# Altium schematic sheet MASTER.SchDoc: MASTER
size A; Author: Keshav Raj, Tim Loretto; DocumentNumber: 1; Revision: 1.0; SheetNumber: 1; SheetTotal: 4
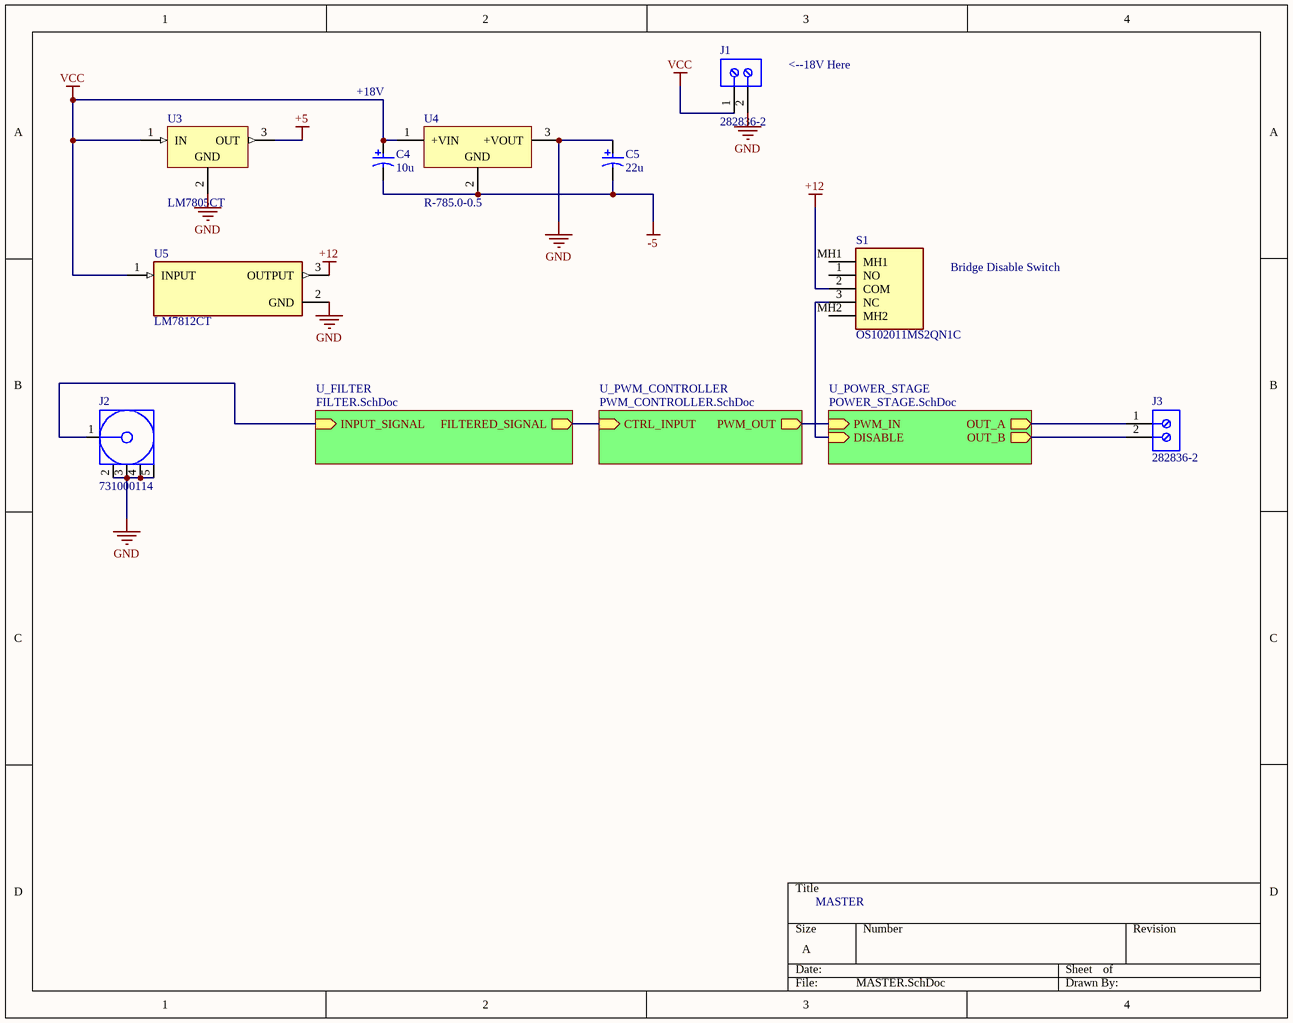
[diagram p0: MASTER.SchDoc]

## Parts
C4  10u  [PNSC-ECA-1VM221-2]
C5  22u  [PNSC-ECA-1VM221-2]
J1  282836-2  [TECO-282836-2_V]
J2  731000114  [MOLX-731000114_V]
J3  282836-2  [TECO-282836-2_V]
S1  OS102011MS2QN1C  [OS102011MS2QN1C]
U3  LM7805CT  [FAIR-TO-220-3]
U4  R-785.0-0.5  [REPO-R-78XX-3_V]
U5  LM7812CT  [FP-TO220B03-MFG]

## Sub-sheets
U_FILTER = FILTER.SchDoc: FILTERED_SIGNAL (out), INPUT_SIGNAL (in)
U_POWER_STAGE = POWER_STAGE.SchDoc: PWM_IN (in), DISABLE (in), OUT_A (out), OUT_B (out)
U_PWM_CONTROLLER = PWM_CONTROLLER.SchDoc: CTRL_INPUT (in), PWM_OUT (out)

## Nets
+5: U3.3(OUT)
+12: S1.2(COM) U5.3(OUTPUT)
-5: C4.2 C5.2 U4.2(GND)
GND: C5.1 J1.2 J2.2 J2.3 J2.4 J2.5 U3.2(GND) U4.3(+VOUT) U5.2(GND)
VCC: C4.1 J1.1 U3.1(IN) U4.1(+VIN) U5.1(INPUT)
NetJ2_1: J2.1 ; sheet U_FILTER/INPUT_SIGNAL
NetJ3_1: J3.1 ; sheet U_POWER_STAGE/OUT_A
NetJ3_2: J3.2 ; sheet U_POWER_STAGE/OUT_B
NetS1_3: S1.3(NC) ; sheet U_POWER_STAGE/DISABLE
(unnamed): sheet U_PWM_CONTROLLER/CTRL_INPUT, sheet U_FILTER/FILTERED_SIGNAL
(unnamed): sheet U_PWM_CONTROLLER/PWM_OUT, sheet U_POWER_STAGE/PWM_IN

Not connected (* = marked no-connect by the designer): S1 1(NO) MH1 MH2

## Notes on the sheet
- +18V
- (near J1) <--18V Here
- Bridge Disable Switch
- MASTER

## Library data of the parts
C4 C5 = CMP-2000-05311-1: Aluminum Electrolytic Capacitor, 220 uF, +/- 20%, 35 V, -40 to 85 degC, 2-Pin THD, RoHS, Bulk; Manufacturer: Panasonic; Lifetime@Temperature: 2000Hrs@85degC; Rated Voltage: 35V; Ripple Current: 350mA; Type: Radial; Capacitance: 220µF; Package Reference: ECA-1VM221; Series: M; Operating Temp Range: -40to+85degC; Package Description: 2-Pin Axial Lead, Dia 8 mm, Body Length 12.5 mm; Datasheet Version: Mar-06; Datasheet URL: https://datasheet.ciiva.com/26341/441851-da-01-en-elko-eca1vm221-m-r-220myf-35v-85c-26341906.pdf; Operating Temp-Max: 85degC; Case Size/Dimension: Ø8x11.5mm; Manufacturer URL: http://www.panasonic.com/
J1 J3 = CMP-1684-00017-1: Female Header, Pitch 5 mm, 1 x 2 Position, Height 10 mm, Tail Length 3.5 mm, Rohs, Bulk; Manufacturer: TE Connectivity; Wire Gauge: 16-30AWG; Product Training Modules: Wire-to-BoardEurostyleTerminalBlocks; Clamp Material - Plating: Brass-NickelPlated; Voltage: 300V; Mating Orientation: HorizontalwithBoard; Current: 13.5A; Pitch: 0.197"(5.00mm); Screw Thread: M3; 3D Model: 282836-2.pdf; Other Names: 5ULV-02B / A98076; Dynamic Catalog: BuchananSeries; Number of Levels: 1; Torque - Screw: 0.68Nm(6Lb-In); Featured Product: EurostyleTerminalBlockConnectors; Positions Per Level: 2; Wire Termination: Screw-RisingCageClamp; Datasheet URL: http://www.te.com.cn/commerce/DocumentDelivery/DDEController?Action=showdoc&DocId=Catalog+Section%7F1308389_EUROSTYLE_TERMINAL_BLOCKS%7F0607%7Fpdf%7FEnglish%7FENG_CS_1308389_EUROSTYLE_TERMINAL_BLOCKS_0607.pdf%7F282836-2; Color: Green; Family: TerminalBlocks-WiretoBoard; RoHS Information: 282836-2StatementofCompliance; Standard Package: 300; Contact Material - Plating: Brass-TinPlated; Manufacturer URL: http://www.te.com; Housing Material: Polyamide(PA66),Nylon6/6; Features: Interlocking(Side); Package Description: Female Header, Pitch 5 mm, 1 x 2 Position, Height 10 mm, Tail Length 3.5 mm; Mounting Type: ThroughHole; Package Reference: THD; Packaging: Bulk; Series: Buchanan; Category: Connectors,Interconnects; Screw Material - Plating: Brass-NickelPlated
J2 = CMP-2000-05487-1: SMA Right-Angle PCB Jack Receptacle, Brass Body, Gold Plated, 50 Ohm, 5-Pin THD, RoHS, Tray; Manufacturer: Molex; Datasheet Version: 09/2016; Package Description: 5-Pin Through Hole Device, Body 14.8 x 6.35 mm, Pitch 2.54 mm; Datasheet URL: http://www.molex.com/webdocs/datasheets/pdf/en-us/0731000114_RF_COAX_CONNECTORS.pdf; Manufacturer URL: http://www.molex.com/; Package Reference: 731000114; Mounting Technology: ThroughHole; Package URL: http://www.molex.com/pdm_docs/sd/731000114_sd.pdf
S1 = OS102011MS2QN1C: Switch; Manufacturer_Name: C & K COMPONENTS; Datasheet Link: http://uk.rs-online.com/web/p/products/1546147; Height: 8.7mm; Manufacturer_Part_Number: OS102011MS2QN1C; Arrow Part Number: OS102011MS2QN1C; Mouser Part Number: 611-OS102011MS2QN1C; Mouser Price/Stock: https://www.mouser.co.uk/ProductDetail/CK/OS102011MS2QN1C?qs=FgXbtR4Gg7KP4hs8ueQ7Wg%3D%3D
U3 = CMP-2000-04938-1: Positive Voltage Regulator, 5 V, 1 A, -40 to 125 degC, 3-Pin TO-220, RoHS, Tube; Manufacturer: FairchildSemiconductor; Maximum Input Voltage: 35V; Maximum Quiescent Current: 8mA; Load Regulation: 100mV; Maximum Output Current: 2.2(Typ)A; Output Type: Fixed; Typical Dropout Voltage @ Current: 2@1AV; Rad Hard: No; Output Voltage: 5V; Accuracy: ±4%; Number of Outputs: 1; Category: LinearRegulator; Package Description: 3-Pin Through Hole Device, Body 10 x 4.5 mm, Pitch 2.54 mm; Packaging: Rail/Tube; Mounting: ThroughHole; Polarity: Positive; Manufacturer URL: https://www.fairchildsemi.com/; Line Regulation: 100mV; Datasheet Version: Aug-12; Datasheet URL: https://datasheet.ciiva.com/26904/lm7805ct-26904988.pdf; Package Reference: TO-220; Package URL: https://www.fairchildsemi.com/package-drawings/TO/TO220B03.pdf; Package: 3TO-220AB; Operating Temperature: -40to125degC; Type: Linear
U4 = CMP-2000-05328-1: DC/DC-Converter, 5 V Single Output, 500 mA, -40 to 85 degC, 3-Pin THD, RoHS, Tube; Manufacturer: Recom Power; Input Voltage: 6.5to34V; Output Voltage: 5V; Form Factor: 11.5x7.6x14.3mm; Isolation: NonIsolated; Datasheet Version: Mar-06; Datasheet URL: https://datasheet.ciiva.com/29153/154483-da-01-en-dc-dc-wandler-innoline-r-785-0-0-5-sip3-29153550.pdf; Manufacturer URL: http://www.recom-power.com/us/americas/home.html; No of Outputs: Single; Type: Encapsulated
U5 = CMP-07128-000015-1: IC REG LINEAR 12V 1A TO220-3; Obsolete Part: true; Manufacturer: ON Semiconductor; Nominal Supply Current: 5.1mA; Output Type: Fixed; Dropout Voltage: 2V; Max Supply Voltage: 35V; Accuracy Percentage: 4%; Standoff Height: 2.7mm; Number Of Outputs: 1; Octopart: https://octopart.com/lm7812ct-on+semiconductor-14383031; Output Current: 1A; ComponentLink2Description: Datasheet; Device Class L1: Integrated Circuits (ICs); Device Class L2: Power Management ICs; Temperature Range Low: -40°C; Category: IC; Package: TO220B03; Device Class L3: Voltage Regulators - Linear; RoHS: TRUE; Digikey Description: IC REG LINEAR 12V 1A TO220-3; Ipc Land Pattern Name: TO-220; Output Voltage: 12V; Temperature: -40°C to +125°C; Automotive: No; Temperature Range High: +125°C; ComponentLink2URL: https://www.mouser.in/datasheet/2/308/LM7812-1125088.pdf; Manufacturer Part Number: LM7812CT; Height: 20.4mm; Lead Free: Yes